# Altium schematic sheet WIFI.SchDoc
size A
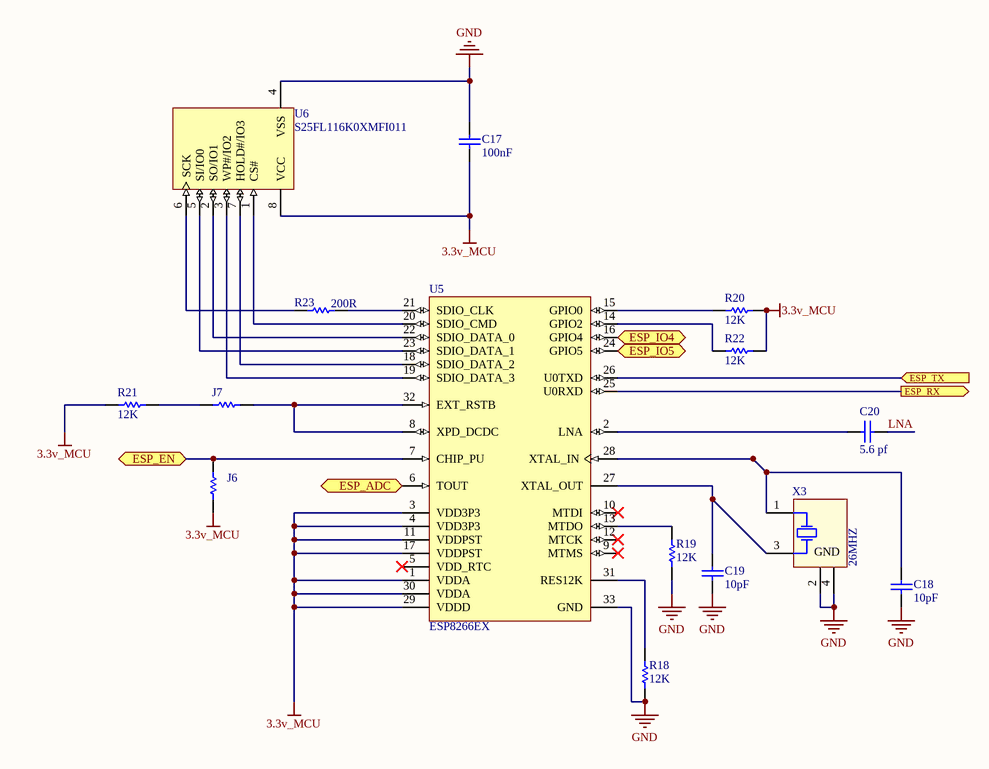
[diagram p0: WIFI.SchDoc]

## Parts
C17  100nF  [CAPC0603(1608)100_L]
C18  10pF  [CAPC0603(1608)100_L]
C19  10pF  [CAPC0603(1608)100_L]
C20  5.6 pf  [CAPC0603(1608)100_L]
J6  (no value)  [RESC1608X55X30LL10T20_A]
J7  (no value)  [RESC1608X55X30LL10T20_A]
R18  12K  [RESC1609X55X30LL15T15]
R19  12K  [RESC1609X55X30LL15T15]
R20  12K  [RESC1609X55X30LL15T15]
R21  12K  [RESC1609X55X30LL15T15]
R22  12K  [RESC1609X55X30LL15T15]
R23  200R  [RESC0603(1608)_L]
U5  ESP8266EX  [ESFS-QFN-32_M]
U6  S25FL116K0XMFI011  [CYP-SOC-8_L]
X3  26MHZ  [NDK-NX2016SA-26MHZ-EXS00A-CS06025-4_V]

## Ports
ESP_ADC (bidir), ESP_EN (bidir), ESP_IO4 (bidir), ESP_IO5 (bidir), ESP_RX (out), ESP_TX (in)

## Nets
3.3v_MCU: C17.2 J6.1 R20.1 R21.2 R22.1 U5.1(VDDA) U5.3(VDD3P3) U5.4(VDD3P3) U5.11(VDDPST) U5.17(VDDPST) U5.29(VDDD) U5.30(VDDA) U6.8(VCC)
GND: C17.1 C18.1 C19.1 R18.1 R19.1 U5.33(GND) U6.4(VSS) X3.2(GND) X3.4(GND)
ESP_ADC: U5.6(TOUT) ; port ESP_ADC
ESP_EN: J6.2 U5.7(CHIP_PU) ; port ESP_EN
ESP_IO4: U5.16(GPIO4) ; port ESP_IO4
ESP_IO5: U5.24(GPIO5) ; port ESP_IO5
ESP_RX: U5.25(U0RXD) ; port ESP_RX
ESP_TX: U5.26(U0TXD) ; port ESP_TX
LNA: C20.2
NetC18_2: C18.2 U5.28(XTAL_IN) X3.1(X1)
NetC19_2: C19.2 U5.27(XTAL_OUT) X3.3(X2)
NetC20_1: C20.1 U5.2(LNA)
NetJ7_1: J7.1 U5.8(XPD_DCDC) U5.32(EXT_RSTB)
NetJ7_2: J7.2 R21.1
NetR18_2: R18.2 U5.31(RES12K)
NetR19_2: R19.2 U5.13(MTDO)
NetR20_2: R20.2 U5.15(GPIO0)
NetR22_2: R22.2 U5.14(GPIO2)
NetR23_1: R23.1 U6.6(SCK)
NetR23_2: R23.2 U5.21(SDIO_CLK)
NetU5_18: U5.18(SDIO_DATA_2) U6.7(HOLD#/IO3)
NetU5_19: U5.19(SDIO_DATA_3) U6.3(WP#/IO2)
NetU5_20: U5.20(SDIO_CMD) U6.1(CS#)
NetU5_22: U5.22(SDIO_DATA_0) U6.2(SO/IO1)
NetU5_23: U5.23(SDIO_DATA_1) U6.5(SI/IO0)

Not connected (* = marked no-connect by the designer): U5 5(VDD_RTC)* 9(MTMS)* 10(MTDI)* 12(MTCK)*

## Library data of the parts
C17 = CMP-1035-02583-1: CAP 100nF 16V ±5% 0603 (1608 Metric) Thickness 1mm SMD; Tolerance: Â±5%; Case-Metric: 1608; Case-EIA: 0603; Rated Voltage: 16 V; Max Thickness: 1 mm; Technology: SMT; Value: 100nF
C18 C19 = CMP-1035-00542-1: CAP 10pF 16V ±1% 0603 (1608 Metric) Thickness 1mm SMD; Tolerance: Â±1%; Case-EIA: 0603; Case-Metric: 1608; Value: 10pF; Rated Voltage: 16 V; Technology: SMT; Max Thickness: 1 mm
C20 = CMP-1035-00372-1: CAP 5.6pF 25V ±0.1pF 0603 (1608 Metric) Thickness 1mm SMD; Case-Metric: 1608; Tolerance: Â±0.1pF; Case-EIA: 0603; Value: 5.6pF; Rated Voltage: 25 V; Max Thickness: 1 mm; Technology: SMT
J6 J7 = CMP-2000-06686-1: Chip Resistor, 0 Ohm, +/- 5%, 100 mW, -55 to 155 degC, 0603 (1608 Metric), RoHS, Tape and Reel; Manufacturer: Rohm; Tolerance: Jumper; Power (Watts): 0.1W,1/10W; Resistance (Ohms): 0.0; Online Catalog: MCR03Series; EDA / CAD Models: DownloadfromAcceleratedDesigns; Other Names: RHM0.0CGTR; Series: MCR; Package Description: 2-Pin Surface Mount Device, Body 1.60 x 0.80 mm; Composition: ThickFilm; Height: 0.022"(0.55mm); Mounting Technology: SurfaceMount; Family: ChipResistor-SurfaceMount; Temperature Coefficient: -; Category: Resistors; Supplier Device Package: 0603(1608Metric); Package Reference: 0603; Size / Dimension: 0.063"Lx0.031"W(1.60mmx0.80mm); Standard Package: 5,000; Datasheet URL: http://www.rohm.com/web/global/datasheet/MCR03ERTJ; Features: -; Datasheet Version: Rev. F, 02/2015; Operating Temperature: -55°C~155°C; Package / Case: 0603(1608Metric); Manufacturer URL: http://www.rohm.com/web/global/; Packaging: Tape&Reel(TR); Number of Terminations: 2
R18-R22 = CMP-2100-03631-1: Chip Resistor, 12 KOhm, +/- 1%, 0.1 W, -55 to 155 degC, 0603 (1608 Metric), RoHS, Tape and Reel; Manufacturer: Panasonic; Power Rating: 100mW; Temperature Coefficient: 100ppm/degreesC; Voltage Rating (DC): 75V; Resistance: 12KOhm; REACH SVHC: NoSVHC; Composition: ThickFilm; Case/Package: 0603; RoHSCompliant: true; Package URL: http://www.st.com/st-web-ui/static/active/en/resource/technical/document/datasheet/CD00001320.pdf; Radiation Hardening: No; Height: 0.022inch; Termination: SMD/SMT; Number of Pins: 2; Package Description: 2-Pin Surface Mount Device, Body 1.6 x 0.85 mm; Datasheet URL: https://industrial.panasonic.com/cdbs/www-data/pdf/RDA0000/AOA0000C283.pdf; Width: 0.031inch; Length: 1.6mm; Datasheet Version: 42095.0; Manufacturer URL: http://www.panasonic.com/; Number of Terminations: 2; Case Code (Imperial): 0603; Depth: 0.8mm; Package Quantity: 1; Package Reference: 0603; Case Code (Metric): 1608; Lead Free: LeadFree; Military Standard: Not; Max Power Dissipation: 100mW; Min Operating Temperature: -55degC; Max Operating Temperature: 155degC; Contact Plating: Tin; Voltage Rating: 75V; Weight: 7.1E-05oz; Mount: SurfaceMount; Packaging: TapeandReel; Tolerance: 1%
R23 = CMP-1012-00429-1: 200R 0.1W 1% 0603 (1608 Metric)  SMD; Value: 200.00 Ohm; Case-EIA: 0603; Case-Metric: 1608; Tolerance: 1 %; Technology: SMT; Power: 0.1 W
U5 = CMP-2000-07453-1: Low-Power, Highly-Integrated Wi-Fi Solution, 2.5 to 3.6 V, 80 mA, -40 to 125 degC, 32-Pin QFN; Manufacturer: Espressif Systems; Mounting Technology: SurfaceMount; Datasheet URL: http://espressif.com/sites/default/files/documentation/0a-esp8266ex_datasheet_en.pdf; Package Reference: QFN-32; Package Description: 32-Pin Quad Falt No-Lead, Body 5 x 5 mm, Pitch 0.5 mm; Manufacturer URL: http://espressif.com; Datasheet Version: Rev. 5.4, 04/2017
U6 = CMP-2000-07015-1: SPI Flash Memory, 16 Mbit, 2.7 to 3.6 V, -40 to 85 degC, 8-Pin SOIC, RoHS, Tube; Manufacturer: CypressSemiconductorCorp; Memory Type: FLASH-NOR; Interface: SPISerial; Speed: 108MHz; Voltage - Supply: 2.7V~3.6V; Memory Size: 16M(2Mx8); Supplier Device Package: 8-SO; Family: Memory; Manufacturer URL: http://www.cypress.com/; Format - Memory: FLASH; Series: FL1-K; Category: IntegratedCircuits(ICs); Datasheet Version: Rev. *E, 06/2016; Package Description: 8-Pin Small Outline Integrated Circuit, Body 5.283 x 5.283 mm, Pitch 1.27 mm; Operating Temperature: -40°C~85°C(TA); Mounting Technology: SurfaceMount; Packaging: Tube; Package / Case: 8-SOIC(0.209",5.30mmWidth); Package Reference: SOIC-8; Datasheet URL: http://www.cypress.com/file/196886/download
X3 = CMP-0454-00001-2: Crystal, 26 MHz, 8 pF, for OA / AV / Short-range Wireless, -10 to 75 degC, 2.0 x 1.6 x 0.45 mm SMD; PartNumber: NX2016SA-26MHZ-EXS00A-CS06025; Manufacturer: NDK; Level of drive: 10 uW (Max. 200 uW); Overtone Order: Fundamental; Load Capacitance: 8 pF; Operating Temperature: -10 to 75 degC; ComponentLink1Description: Manufacturer URL; ComponentLink3Description: Package Specification; ComponentLink3URL: http://www.ndk.com/images/products/catalog/c_NX2016SA-STD-CZS-1_e.pdf; PackageDescription: 4-Pin Hand Drawn, Body 2x1.6mm; Storage temperature range: -40 to 85 degC; ComponentLink1URL: https://www.ndk.com; Mounting Technology: Surface Mount; Nominal Frequency: 26 MHz; PackageReference: NX2016SA-26MHZ-EXS00A-CS06025-4; ComponentLink2Description: Datasheet; ComponentLink2URL: http://www.ndk.com/images/products/catalog/c_NX2016SA-STD-CZS-1_e.pdf